# Altium schematic sheet MCU.SchDoc
size A4; SheetNumber: 5; SheetTotal: 5
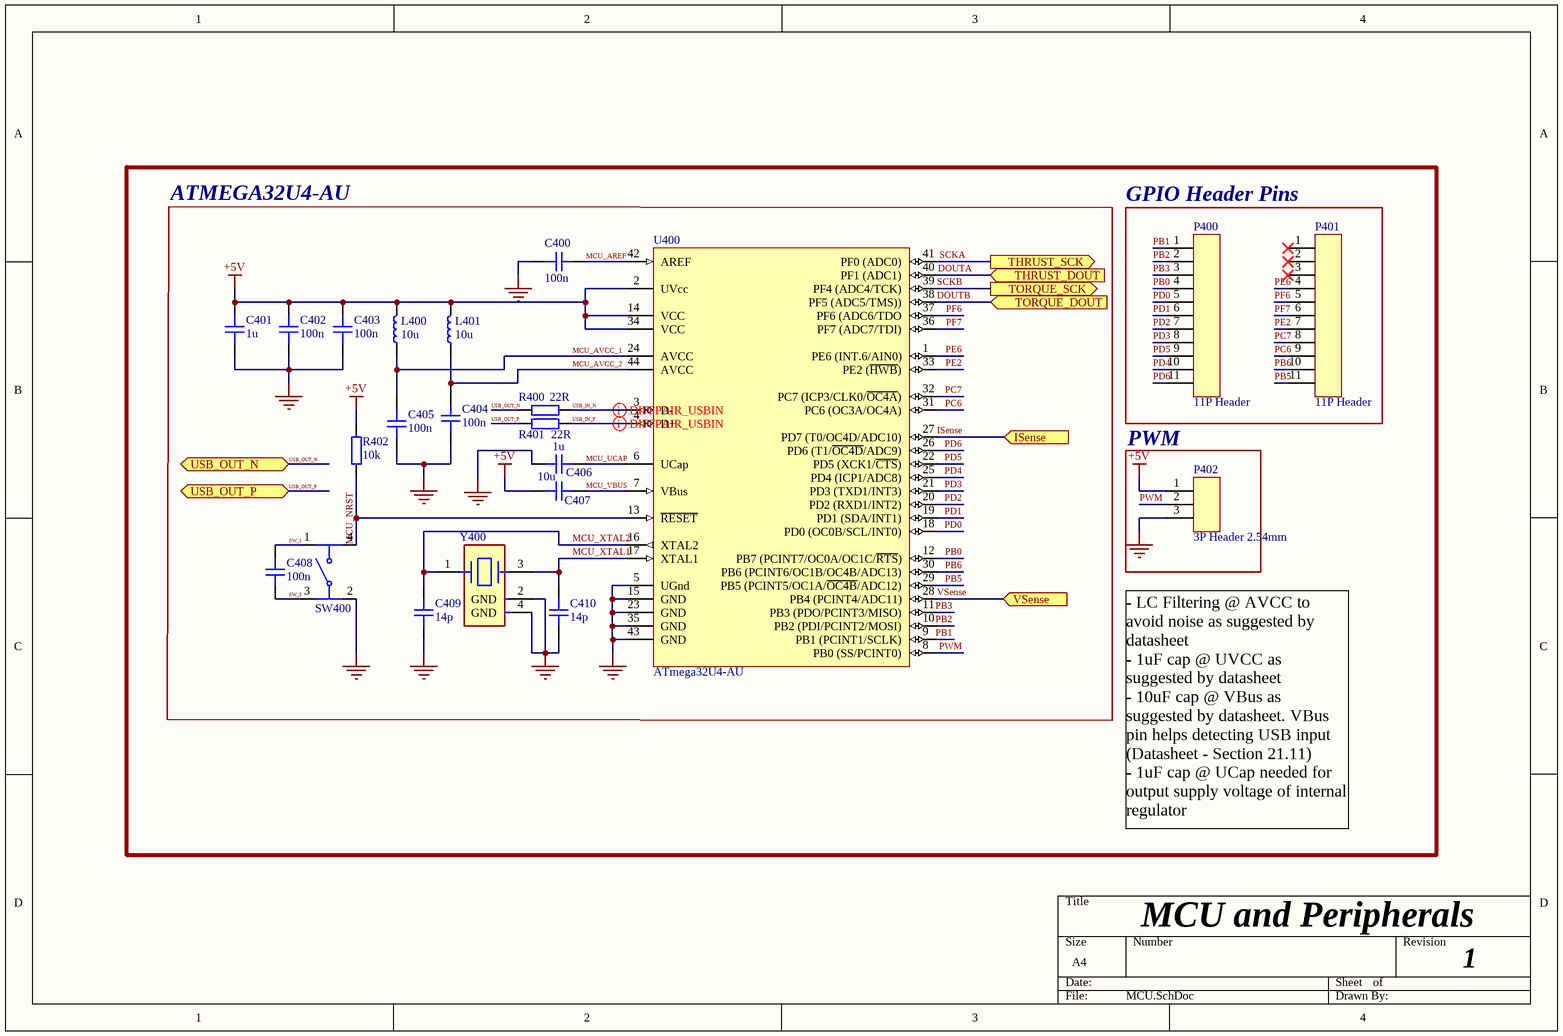
[diagram p0: MCU.SchDoc]

## Parts
C400  100n  [CAP_0603]
C401  1u  [CAP_0603]
C402  100n  [CAP_0603]
C403  100n  [CAP_0603]
C404  100n  [CAP_0603]
C405  100n  [CAP_0603]
C406  1u  [CAP_0603]
C407  10u  [CAP_0603]
C408  100n  [CAP_0603]
C409  14p  [CAP_0603]
C410  14p  [CAP_0603]
L400  10u  [IND_0603]
L401  10u  [IND_0603]
P400  11P Header  [PZ254-1-11-Z-2.5-G1]
P401  11P Header  [PZ254-1-11-Z-2.5-G1]
P402  3P Header 2.54mm  [3P Header 2.54mm]
R400  22R  [RES_0603]
R401  22R  [RES_0603]
R402  10k  [RES_0603]
SW400  C318884  [C318884]  (value not drawn)
U400  ATmega32U4-AU  [44ML_M]
Y400  7M-16.000MEEQ-T  [FP-7M-MFG]  (value not drawn)

## Blocks framed on the sheet
ATMEGA32U4-AU: C400-C410 L400 L401 R400-R402 SW400 U400 Y400
GPIO Header Pins: P400 P401
PWM: P402

## Ports
ISense (in, see Thrust Stand Controller Revised[3C], Power Monitor[4B]), THRUST_DOUT (in, see Thrust Stand Controller Revised[3B]), THRUST_SCK (out, see Thrust Stand Controller Revised[3B]), TORQUE_DOUT (in, see Thrust Stand Controller Revised[3C]), TORQUE_SCK (out, see Thrust Stand Controller Revised[3B]), USB_OUT_N (bidir, see Thrust Stand Controller Revised[2B], USB-C[3B]), USB_OUT_P (bidir, see Thrust Stand Controller Revised[2C], USB-C[3C]), VSense (in, see Thrust Stand Controller Revised[3C], Power Monitor[3B])

## Nets
+5V: C401.2 C402.2 C403.2 C407.2 L400.2 L401.2 P402.1 R402.2 U400.2(UVcc) U400.14(VCC) U400.34(VCC)
GND: C400.2 C401.1 C402.1 C403.1 C404.1 C405.1 C406.2 C409.1 C410.1 P402.3 SW400.2 U400.5(UGnd) U400.15(GND) U400.23(GND) U400.35(GND) U400.43(GND) Y400.2(GND) Y400.4(GND)
DOUTA: U400.40(PF1_(ADC1)) ; port THRUST_DOUT
DOUTB: U400.38(PF5_(ADC5/TMS))) ; port TORQUE_DOUT
ISense: U400.27(PD7_(T0/OC4D/ADC10)) ; port ISense
MCU_AREF: C400.1 U400.42(AREF)
MCU_AVCC_1: C405.2 L400.1 U400.24(AVCC)
MCU_AVCC_2: C404.2 L401.1 U400.44(AVCC)
MCU_NRST: R402.1 SW400.4 U400.13(~{RESET})
MCU_UCAP: C406.1 U400.6(UCap)
MCU_VBUS: C407.1 U400.7(VBus)
MCU_XTAL1: C410.2 U400.17(XTAL1) Y400.3
MCU_XTAL2: C409.2 U400.16(XTAL2) Y400.1
PB0: P400.4 U400.12(PB7_(PCINT7/OC0A/OC1C/~{RTS}))
PB1: P400.1 U400.9(PB1_(PCINT1/SCLK))
PB2: P400.2 U400.10(PB2_(PDI/PCINT2/MOSI))
PB3: P400.3 U400.11(PB3_(PDO/PCINT3/MISO))
PB5: P401.11 U400.29(PB5_(PCINT5/OC1A/~{OC4B}/ADC12))
PB6: P401.10 U400.30(PB6_(PCINT6/OC1B/OC4B/ADC13))
PC6: P401.9 U400.31(PC6_(OC3A/OC4A))
PC7: P401.8 U400.32(PC7_(ICP3/CLK0/~{OC4A}))
PD0: P400.5 U400.18(PD0_(OC0B/SCL/INT0))
PD1: P400.6 U400.19(PD1_(SDA/INT1))
PD2: P400.7 U400.20(PD2_(RXD1/INT2))
PD3: P400.8 U400.21(PD3_(TXD1/INT3))
PD4: P400.10 U400.25(PD4_(ICP1/ADC8))
PD5: P400.9 U400.22(PD5_(XCK1/~{CTS}))
PD6: P400.11 U400.26(PD6_(T1/~{OC4D}/ADC9))
PE2: P401.7 U400.33(PE2_(~{HWB}))
PE6: P401.4 U400.1(PE6_(INT.6/AIN0))
PF6: P401.5 U400.37(PF6_(ADC6/TDO)
PF7: P401.6 U400.36(PF7_(ADC7/TDI))
PWM: P402.2 U400.8(PB0_(SS/PCINT0))
SCKA: U400.41(PF0_(ADC0)) ; port THRUST_SCK
SCKB: U400.39(PF4_(ADC4/TCK)) ; port TORQUE_SCK
SW_1: C408.2 SW400.1
SW_3: C408.1 SW400.3
USB_IN_N: R400.2 U400.3(D-)
USB_IN_P: R401.2 U400.4(D+)
USB_OUT_N: R400.1 ; port USB_OUT_N
USB_OUT_P: R401.1 ; port USB_OUT_P
VSense: U400.28(PB4_(PCINT4/ADC11)) ; port VSense

Not connected (* = marked no-connect by the designer): P401 1* 2* 3*

## Layout directives
differential pair; differential pair class USB_IN; rule Differential Pairs Routing [Pref Gap = 0.203mm    Min Gap  = 0.203mm    Max Gap  = 0.203mmPref Width = 0.281mm    Min Width  = 0.281mm    Max Width  = 0.281mm]: USB_IN_N, USB_IN_P

## Notes on the sheet
- - LC Filtering @ AVCC to avoid noise as suggested by datasheet                                                    - 1uF cap @ UVCC as suggested by datasheet                                                    - 10uF cap @ VBus as suggested by datasheet. VBus pin helps detecting USB input (Datasheet - Section 21.11)              - 1uF cap @ UCap needed for output supply voltage of internal regulator
- MCU and Peripherals
- 1

## Library data of the parts
C400-C410 = CAP_0603: Capacitor SMD 0603; Manufacturer: *; Manufacturer Part Number: *; Distributor Link: *; LCSC: *; Rating: *; Dielectric: *
L400 L401 = IND_0603: Inductor SMD 0603
P400 P401 = PZ254-1-11-Z-2.5-G1: 3A Direct Insert Policy 2.5mm 260℃@10S 11P 6mm -40℃~+105℃ 3mm 2.54mm Brass Black Single Row 1x11P Plugin,P=2.54mm Pin Headers ROHS; Manufacturer: HCTL; MFR. Part Number: PZ254-1-11-Z-2.5-G1; JLCPCB Part Number: C18197918
P402 = PZ254V-11-03P: 250V 3A Direct Insert Policy 2.5mm 3P 6mm -40℃~+105℃ 3mm 2.54mm Single Row Black 1x3P Plugin,P=2.54mm Pin Headers ROHS; Manufacturer: XFCN; MFR. Part #: PZ254V-11-03P; JLCPCB Part #: C2937625; Package: Plugin,P=2.54mm
R400-R402 = RES_0603: Resistor SMD 0603; Manufacturer: *; Manufacturer Part Number: *; Distributor Link: *; LCSC: *
SW400 = C318884: None Without 50mA 5.1mm 100000 Times 160gf 12V 5.1mm 1.5mm Round Button Standing paste SPST SMD Tactile Switches ROHS; Manufacturer: XKB Connection; MFR Part Number: TS-1187 A-B-A-B; JLCPCB Part Number: C318884
U400 = CMP-0095-00285-2: 8-bit AVR Microcontroller, 2.7-5.5V, 16MHz, 32KB Flash, 1KB EEPROM, 2.5KB SRAM, USB Controller, 44-pin TQFP, Industrial Grade (-40°C to 85°C), Ext Osc; RevisionNote: DatasheetVersion updated. URLs added.; ComponentLink1Description: Manufacturer URL; PackageDescription: 44-Pin Plastic Thin Quad Flat Pack, 10 x 10 x 1.0 mm Body, 0.8 mm Pitch (TQFP); DatasheetVersion: revF, Nov-2010; ComponentLink2URL: http://www.atmel.com/dyn/resources/prod_documents/doc7766.pdf; ComponentLink1URL: http://www.atmel.com/; PackageReference: 44ML; ComponentLink2Description: ATmega16U4/32U4 Datasheet; PackageVersion: rev.G, Jul-2007; ComponentLink3URL: http://www.atmel.com/dyn/resources/prod_documents/7766S.pdf; ComponentLink3Description: ATmega16U4 ATmega32U4 Summary
Y400 = CMP-18717-000438-1: Crystal 16MHz, 10ppm, 10pF, 60Ω; ESR (Equivalent Series Resistance): 100R; Width: 2.5mm; REACH SVHC: No SVHC; Mount: Surface Mount; Package Quantity: 1; Depth: 2.5mm; Frequency Tolerance: 10ppm; Length: 3.2mm; Packaging: Tape and Reel; Termination: SMD/SMT; RoHS Compliant: Yes; Max Operating Temperature: 70°C; Min Operating Temperature: -10°C; Tolerance: 10ppm; Frequency Stability: 10ppm; Series: 7M; Height: 0.031inch; Number of Pins: 4; Load Capacitance: 10pF; Frequency: 16MHz; Case/Package: SMD/SMT